# Altium project MercurialSDR.PrjPcb
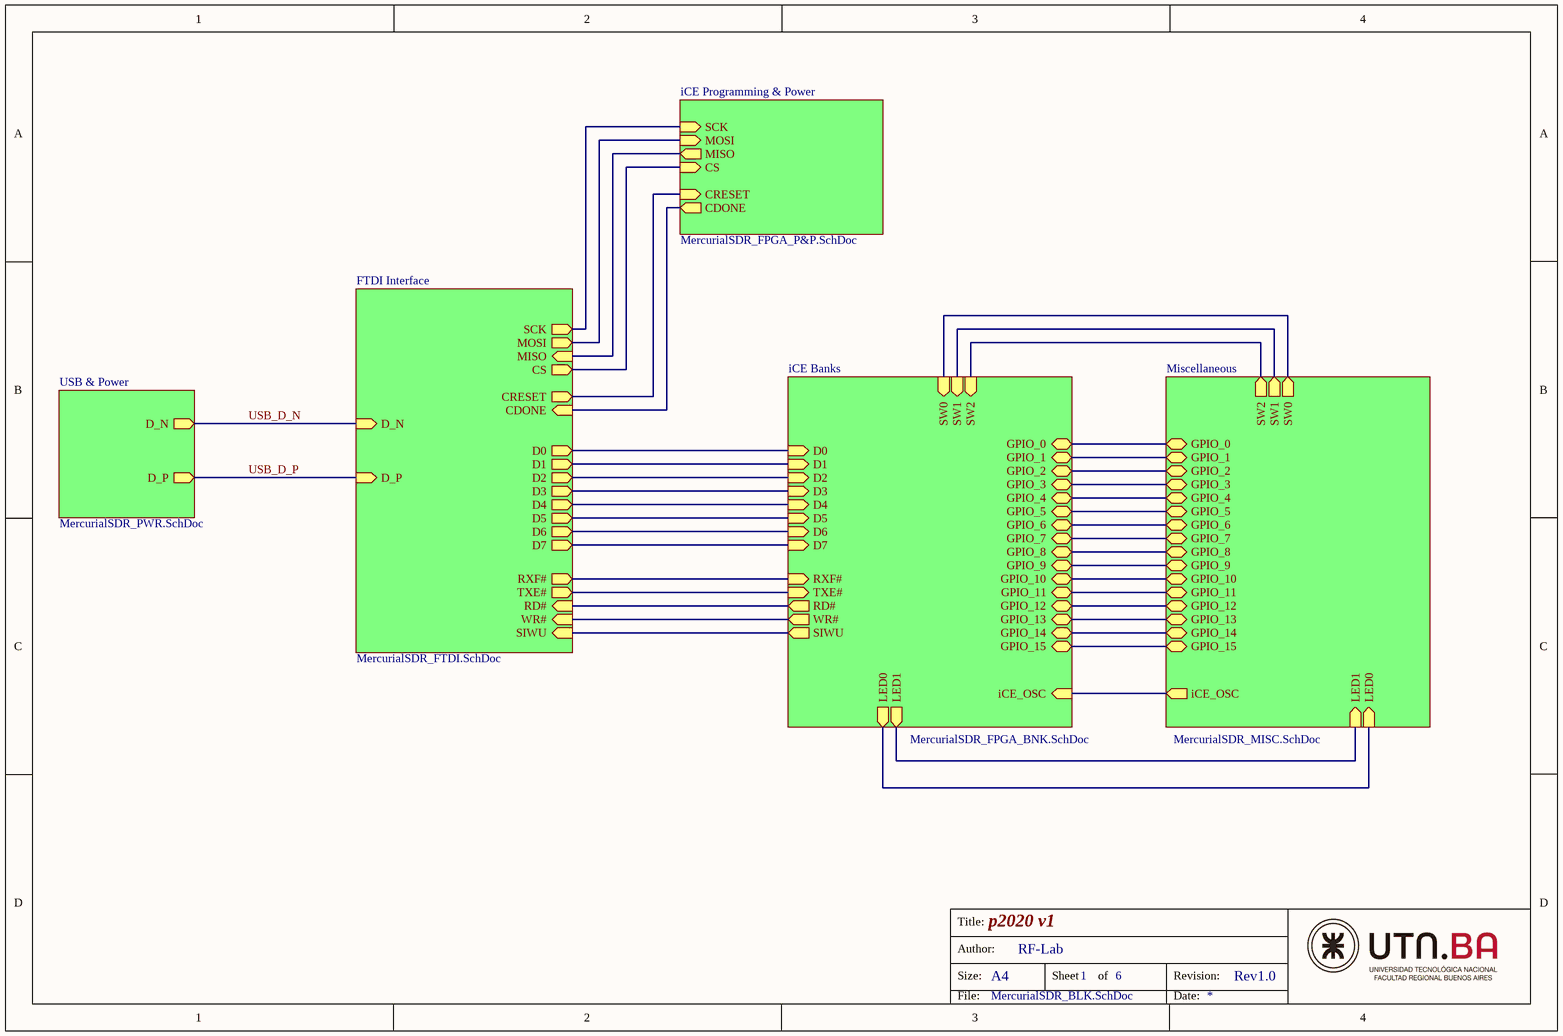
[diagram p0: MercurialSDR_BLK.SchDoc]
6 sheets, 130 parts. Net scope: hierarchical (ports join the sheet entries above them; power ports are global).
Board file: MercurialSDR.PcbDoc
Sheets:
  MercurialSDR_BLK.SchDoc
    Miscellaneous = MercurialSDR_MISC.SchDoc
    iCE Banks = MercurialSDR_FPGA_BNK.SchDoc
    iCE Programming & Power = MercurialSDR_FPGA_P&P.SchDoc
    FTDI Interface = MercurialSDR_FTDI.SchDoc
    USB & Power = MercurialSDR_PWR.SchDoc

## Sheet MercurialSDR_BLK.SchDoc: p2020 v1
size A4; Author: RF-Lab; DrawnBy: RF-Lab; Revision: Rev1.0; SheetNumber: 1; SheetTotal: 6; ProjectName: MercurialSDR

### Sub-sheets
FTDI Interface = MercurialSDR_FTDI.SchDoc: SCK (out), MOSI (out), MISO (in), CS (out), CDONE (in), CRESET (out), D0 (out), D1 (out), D2 (out), D3 (out), D4 (out), D5 (out), D6 (out), D7 (out), RXF# (out), TXE# (out), RD# (in), WR# (in), SIWU (in), D_N (in), D_P (in)
iCE Banks = MercurialSDR_FPGA_BNK.SchDoc: LED0 (out), LED1 (out), SW0 (in), SW1 (in), SW2 (in), GPIO_0 (bidir), GPIO_1 (bidir), GPIO_2 (bidir), GPIO_3 (bidir), GPIO_4 (bidir), GPIO_5 (bidir), GPIO_6 (bidir), GPIO_7 (bidir), GPIO_8 (bidir), GPIO_9 (bidir), GPIO_10 (bidir), GPIO_11 (bidir), GPIO_12 (bidir), GPIO_13 (bidir), GPIO_14 (bidir), GPIO_15 (bidir), D3 (in), RXF# (in), D0 (in), TXE# (in), D7 (in), SIWU (out), D2 (in), D6 (in), D1 (in), D4 (in), WR# (out), RD# (out), D5 (in), iCE_OSC (in)
iCE Programming & Power = MercurialSDR_FPGA_P&P.SchDoc: CRESET (in), CDONE (out), CS (in), SCK (in), MOSI (in), MISO (out)
Miscellaneous = MercurialSDR_MISC.SchDoc: SW0 (out), SW1 (out), SW2 (out), LED0 (in), LED1 (in), GPIO_0 (bidir), GPIO_1 (bidir), GPIO_2 (bidir), GPIO_3 (bidir), GPIO_4 (bidir), GPIO_5 (bidir), GPIO_6 (bidir), GPIO_7 (bidir), GPIO_8 (bidir), GPIO_9 (bidir), GPIO_10 (bidir), GPIO_11 (bidir), GPIO_12 (bidir), GPIO_13 (bidir), GPIO_14 (bidir), GPIO_15 (bidir), iCE_OSC (out)
USB & Power = MercurialSDR_PWR.SchDoc: D_N (out), D_P (out)

### Nets
CDONE_S: sheet iCE Programming & Power/CDONE, sheet FTDI Interface/CDONE
CS_S: sheet iCE Programming & Power/CS, sheet FTDI Interface/CS
MISO_S: sheet iCE Programming & Power/MISO, sheet FTDI Interface/MISO
MOSI_S: sheet iCE Programming & Power/MOSI, sheet FTDI Interface/MOSI
RESET_S: sheet iCE Programming & Power/CRESET, sheet FTDI Interface/CRESET
SCK_S: sheet iCE Programming & Power/SCK, sheet FTDI Interface/SCK
USB_D_N: sheet FTDI Interface/D_N, sheet USB & Power/D_N
USB_D_P: sheet FTDI Interface/D_P, sheet USB & Power/D_P
NetC41_2: sheet Miscellaneous/SW0, sheet iCE Banks/SW0
NetC42_2: sheet Miscellaneous/SW1, sheet iCE Banks/SW1
NetC43_2: sheet Miscellaneous/SW2, sheet iCE Banks/SW2
NetCN1_5: sheet Miscellaneous/GPIO_0, sheet iCE Banks/GPIO_0
NetCN1_6: sheet Miscellaneous/GPIO_1, sheet iCE Banks/GPIO_1
NetCN1_7: sheet Miscellaneous/GPIO_2, sheet iCE Banks/GPIO_2
NetCN1_8: sheet Miscellaneous/GPIO_3, sheet iCE Banks/GPIO_3
NetCN1_9: sheet Miscellaneous/GPIO_4, sheet iCE Banks/GPIO_4
NetCN1_10: sheet Miscellaneous/GPIO_5, sheet iCE Banks/GPIO_5
NetCN1_11: sheet Miscellaneous/GPIO_6, sheet iCE Banks/GPIO_6
NetCN1_12: sheet Miscellaneous/GPIO_7, sheet iCE Banks/GPIO_7
NetCN1_13: sheet Miscellaneous/GPIO_8, sheet iCE Banks/GPIO_8
NetCN1_14: sheet Miscellaneous/GPIO_9, sheet iCE Banks/GPIO_9
NetCN1_15: sheet Miscellaneous/GPIO_10, sheet iCE Banks/GPIO_10
NetCN1_16: sheet Miscellaneous/GPIO_11, sheet iCE Banks/GPIO_11
NetCN1_17: sheet Miscellaneous/GPIO_12, sheet iCE Banks/GPIO_12
NetCN1_18: sheet Miscellaneous/GPIO_13, sheet iCE Banks/GPIO_13
NetCN1_19: sheet Miscellaneous/GPIO_14, sheet iCE Banks/GPIO_14
NetCN1_20: sheet Miscellaneous/GPIO_15, sheet iCE Banks/GPIO_15
NetIC8_38: sheet iCE Banks/D0, sheet FTDI Interface/D0
NetIC8_39: sheet iCE Banks/D1, sheet FTDI Interface/D1
NetIC8_40: sheet iCE Banks/D2, sheet FTDI Interface/D2
NetIC8_41: sheet iCE Banks/D3, sheet FTDI Interface/D3
NetIC8_43: sheet iCE Banks/D4, sheet FTDI Interface/D4
NetIC8_44: sheet iCE Banks/D5, sheet FTDI Interface/D5
NetIC8_45: sheet iCE Banks/D6, sheet FTDI Interface/D6
NetIC8_46: sheet iCE Banks/D7, sheet FTDI Interface/D7
NetIC8_48: sheet iCE Banks/RXF#, sheet FTDI Interface/RXF#
NetIC8_52: sheet iCE Banks/TXE#, sheet FTDI Interface/TXE#
NetIC8_53: sheet iCE Banks/RD#, sheet FTDI Interface/RD#
NetIC8_54: sheet iCE Banks/WR#, sheet FTDI Interface/WR#
NetIC8_55: sheet iCE Banks/SIWU, sheet FTDI Interface/SIWU
NetOSC1_3: sheet Miscellaneous/iCE_OSC, sheet iCE Banks/iCE_OSC
NetR22_2: sheet Miscellaneous/LED0, sheet iCE Banks/LED0
NetR23_2: sheet Miscellaneous/LED1, sheet iCE Banks/LED1

### Notes on the sheet
- Title:
- Size:
- Author:
- A4
- Sheet
- of
- Revision:
- File:
- Date:

## Sheet MercurialSDR_MISC.SchDoc: p2020 v1
size A4; Author: RF-Lab; DrawnBy: RF-Lab; Revision: Rev1.0; SheetNumber: 6; SheetTotal: 6; ProjectName: MercurialSDR
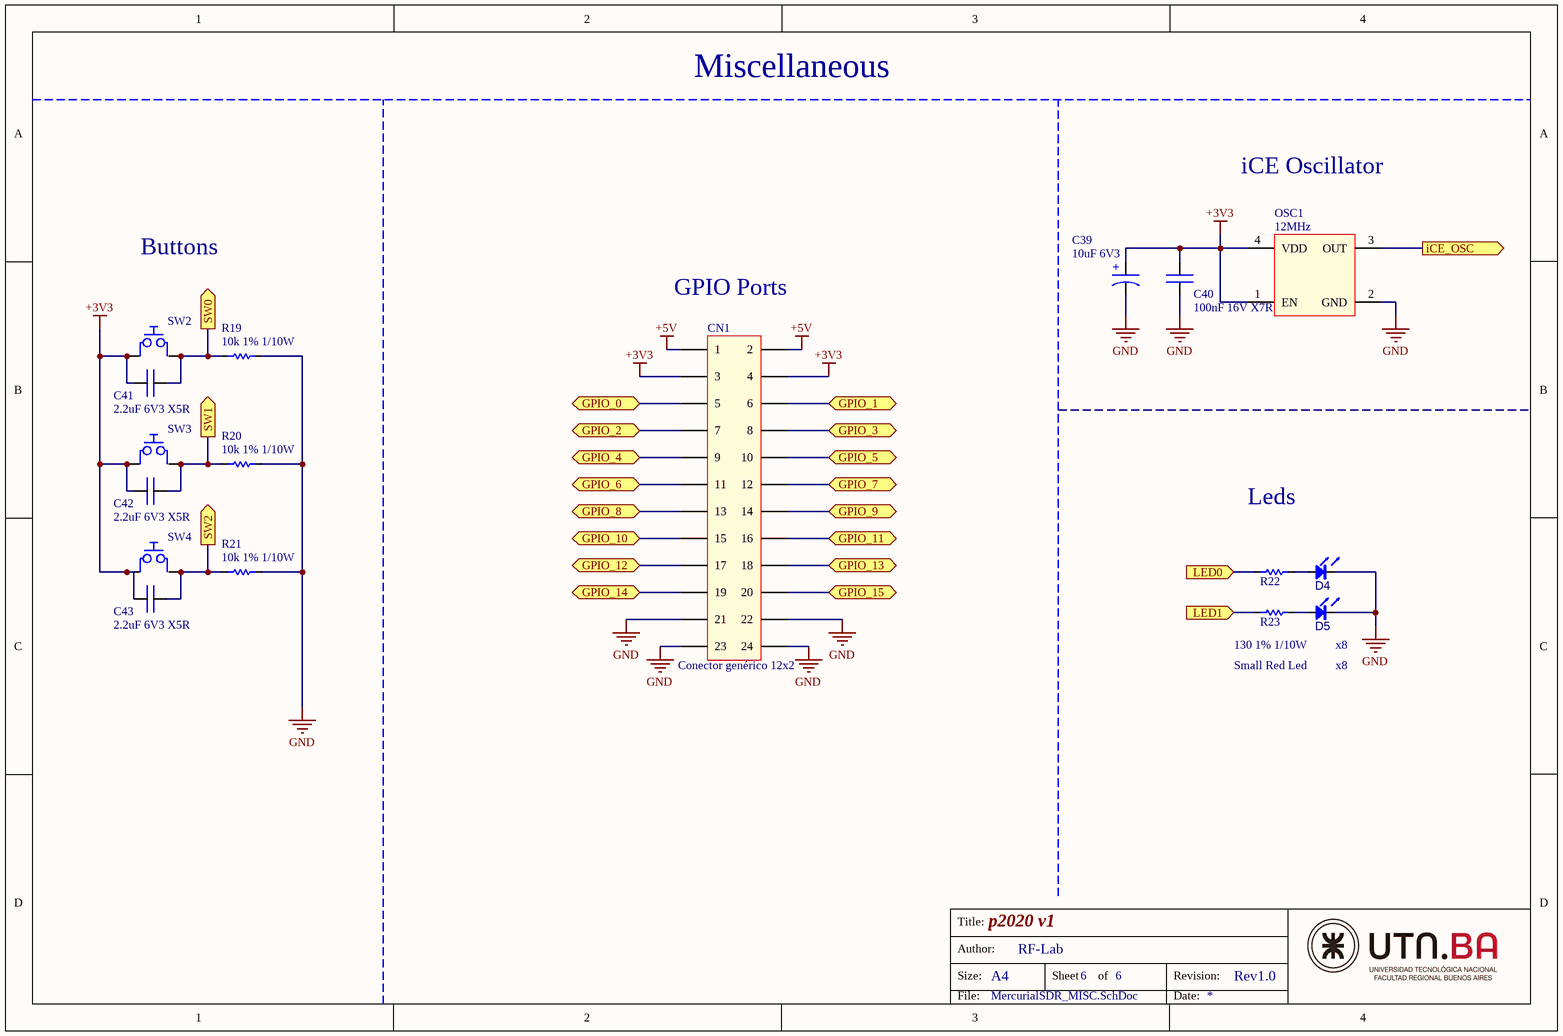
[diagram p1: MercurialSDR_MISC.SchDoc]

### Parts
C39  value 10uF 6V3  [CAP_TANT_1206]  (hidden comment: 10uF 6V3 - TAJA106K006RNJ)
C40  value 100nF 16V X7R  [CAP_0603]  (hidden comment: 100nF 16V X7R - CL10B104KO8NNNC)
C41  value 2.2uF 6V3 X5R  [CAP_0603]  (hidden comment: 2.2uF 6V3 X5R - CL10A225KQ8NNNC)
C42  value 2.2uF 6V3 X5R  [CAP_0603]  (hidden comment: 2.2uF 6V3 X5R - CL10A225KQ8NNNC)
C43  value 2.2uF 6V3 X5R  [CAP_0603]  (hidden comment: 2.2uF 6V3 X5R - CL10A225KQ8NNNC)
CN1  value Conector genérico 12x2  [CON_12x2]  (hidden comment: 6-534236-2 // PPPC122LFBN)
D4  LTST-C190KRKT  [LED_0603]  (value not drawn)
D5  Color: Small Red Led  [LED_0603]  (hidden comment: LTST-C190KRKT)
OSC1  Frequency: 12MHz  [VFLGA_2.5x2.0]  (hidden comment: DSC6003JI2A-012.0000T)
R19  value 10k 1% 1/10W  [RES_0603]  (hidden comment: 10k 1% 1/10W - CR0603-FX-1002EAS)
R20  value 10k 1% 1/10W  [RES_0603]  (hidden comment: 10k 1% 1/10W - CR0603-FX-1002EAS)
R21  value 10k 1% 1/10W  [RES_0603]  (hidden comment: 10k 1% 1/10W - CR0603-FX-1002EAS)
R22  130 1% 1/10W - CR0603-FX-1300ELF  [RES_0603]  (value not drawn)
R23  value 130 1% 1/10W  [RES_0603]  (hidden comment: 130 1% 1/10W - CR0603-FX-1300ELF)
SW2  PTS645SM43SMTR92 LFS  [SWITCH_6X6mm]  (value not drawn)
SW3  PTS645SM43SMTR92 LFS  [SWITCH_6X6mm]  (value not drawn)
SW4  PTS645SM43SMTR92 LFS  [SWITCH_6X6mm]  (value not drawn)

### Ports
GPIO_0 (bidir), GPIO_1 (bidir), GPIO_2 (bidir), GPIO_3 (bidir), GPIO_4 (bidir), GPIO_5 (bidir), GPIO_6 (bidir), GPIO_7 (bidir), GPIO_8 (bidir), GPIO_9 (bidir), GPIO_10 (bidir), GPIO_11 (bidir), GPIO_12 (bidir), GPIO_13 (bidir), GPIO_14 (bidir), GPIO_15 (bidir), iCE_OSC (out), LED0 (in), LED1 (in), SW0 (out), SW1 (out), SW2 (out)

### Nets
+3V3: C39.1 C40.1 C41.1 C42.1 C43.1 CN1.3 CN1.4 OSC1.1(EN) OSC1.4(VDD) SW2.1 SW3.1 SW4.1
+5V: CN1.1 CN1.2
GND: C39.2 C40.2 CN1.21 CN1.22 CN1.23 CN1.24 D4.2(K) D5.2(K) OSC1.2(GND) R19.1 R20.1 R21.1
NetC41_2: C41.2 R19.2 SW2.4 ; port SW0
NetC42_2: C42.2 R20.2 SW3.4 ; port SW1
NetC43_2: C43.2 R21.2 SW4.4 ; port SW2
NetCN1_5: CN1.5 ; port GPIO_0
NetCN1_6: CN1.6 ; port GPIO_1
NetCN1_7: CN1.7 ; port GPIO_2
NetCN1_8: CN1.8 ; port GPIO_3
NetCN1_9: CN1.9 ; port GPIO_4
NetCN1_10: CN1.10 ; port GPIO_5
NetCN1_11: CN1.11 ; port GPIO_6
NetCN1_12: CN1.12 ; port GPIO_7
NetCN1_13: CN1.13 ; port GPIO_8
NetCN1_14: CN1.14 ; port GPIO_9
NetCN1_15: CN1.15 ; port GPIO_10
NetCN1_16: CN1.16 ; port GPIO_11
NetCN1_17: CN1.17 ; port GPIO_12
NetCN1_18: CN1.18 ; port GPIO_13
NetCN1_19: CN1.19 ; port GPIO_14
NetCN1_20: CN1.20 ; port GPIO_15
NetD4_1: D4.1(A) R22.1
NetD5_1: D5.1(A) R23.1
NetOSC1_3: OSC1.3(OUT) ; port iCE_OSC
NetR22_2: R22.2 ; port LED0
NetR23_2: R23.2 ; port LED1

Not connected (* = marked no-connect by the designer): SW2 2 3; SW3 2 3; SW4 2 3

### Notes on the sheet
- Miscellaneous
- iCE Oscillator
- Buttons
- (near CN1) GPIO Ports
- Leds
- x8
- Title:
- Size:
- Author:
- A4
- Sheet
- of
- Revision:
- File:
- Date:
- (in symbol Cap Pol) +

### Library data of the parts
C39 = Cap Pol: Capacitor polarizado
C40 C42 C43 = Cap: Capacitor no polarizado; Material: Ceramic
  C40: Temp Coef: X7R; Part Number: CL10B104KO8NNNC; VR: 16V
  C42 C43: Temp Coef: X5R; Part Number: CL10A225KQ8NNNC; VR: 6V3
C41 = Cap: Capacitor no polarizado
CN1 = CN_12x2: Conector genérico 12x2; Part Number: 6-534236-2
D4 = Led_small: Color: Red; Part Number: LTST-C190KRKT
D5 = Led_small: Part Number: LTST-C190KRKT
OSC1 = Oscillator: Oscilador de 4 terminales; Part Number: DSC6003JI2A-012.0000T
R19-R21 R23 = Res: Resistor
  R23: Power: 1/10W; Part Number: CR0603-FX-1300ELF; Tolerance: 1%
R22 = Res: Resistor; Value: 130; Power: 1/10W; Part Number: CR0603-FX-1300ELF; Tolerance: 1%
SW2-SW4 = Pulsador: Part Number: PTS645SM43SMTR92 LFS

## Sheet MercurialSDR_FPGA_BNK.SchDoc: p2020 v1
size A4; Author: RF-Lab; DrawnBy: RF-Lab; Revision: Rev1.0; SheetNumber: 5; SheetTotal: 6; ProjectName: MercurialSDR
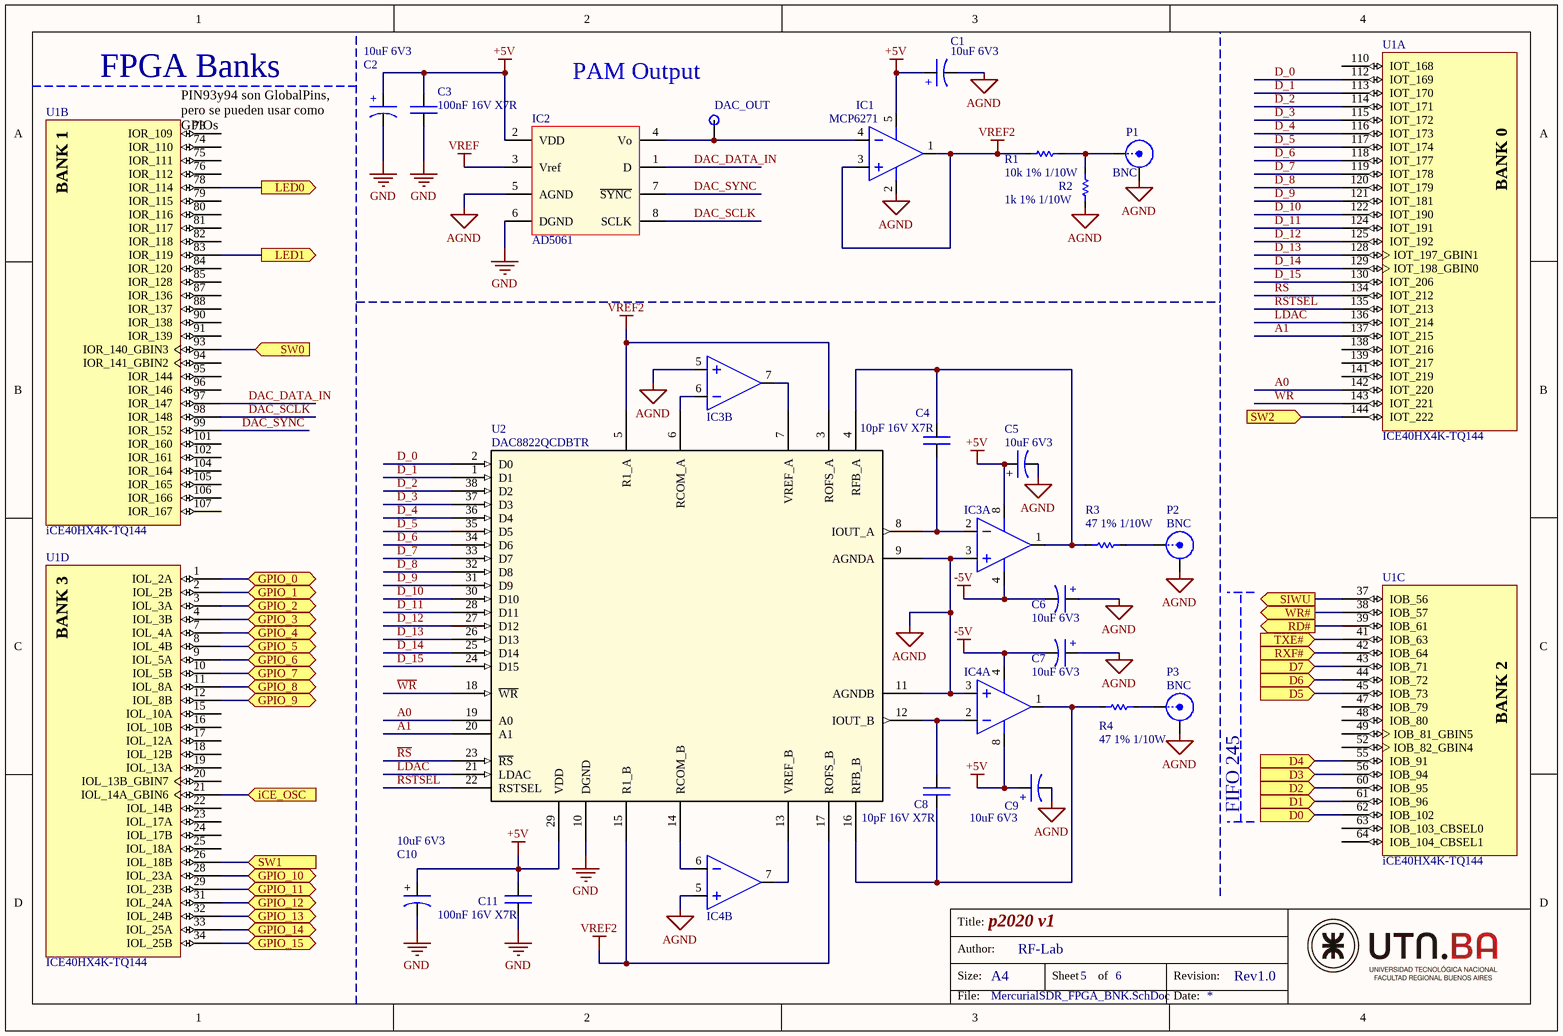
[diagram p2: MercurialSDR_FPGA_BNK.SchDoc]

### Parts
C1  value 10uF 6V3  [CAP_TANT_1206]  (hidden comment: 10uF 6V3 - TAJA106K006RNJ)
C2  value 10uF 6V3  [CAP_TANT_1206]  (hidden comment: 10uF 6V3 - TAJA106K006RNJ)
C3  value 100nF 16V X7R  [CAP_0603]  (hidden comment: 100nF 16V X7R - CL10B104KO8NNNC)
C4  value 10pF 16V X7R  [CAP_0603]  (hidden comment: 10pF 16V X7R - C0603C100K4RAC7867)
C5  value 10uF 6V3  [CAP_TANT_1206]  (hidden comment: 10uF 6V3 - TAJA106K006RNJ)
C6  value 10uF 6V3  [CAP_TANT_1206]  (hidden comment: 10uF 6V3 - TAJA106K006RNJ)
C7  value 10uF 6V3  [CAP_TANT_1206]  (hidden comment: 10uF 6V3 - TAJA106K006RNJ)
C8  value 10pF 16V X7R  [CAP_0603]  (hidden comment: 10pF 16V X7R - C0603C100K4RAC7867)
C9  value 10uF 6V3  [CAP_TANT_1206]  (hidden comment: 10uF 6V3 - TAJA106K006RNJ)
C10  value 10uF 6V3  [CAP_TANT_1206]  (hidden comment: 10uF 6V3 - TAJA106K006RNJ)
C11  value 100nF 16V X7R  [CAP_0603]  (hidden comment: 100nF 16V X7R - CL10B104KO8NNNC)
IC1  Part Number: MCP6271  [SOT-23-5]  (hidden comment: MCP6271 SOT-23-5)
IC2  AD5061  [SOT-23-8]
IC3  OPAMP2277 - OPA2277UA/2K5  [opa2277]  (value not drawn)  (parts A,B of 2)
IC4  OPAMP2277 - OPA2277UA/2K5  [opa2277]  (value not drawn)  (parts A,B of 2)
P1  value BNC  [CONN_73138-5033_]  (hidden comment: 0731385033)
P2  value BNC  [CONN_73138-5033_]  (hidden comment: 0731385033)
P3  value BNC  [CONN_73138-5033_]  (hidden comment: 0731385033)
R1  value 10k 1% 1/10W  [RES_0603]  (hidden comment: 10k 1% 1/10W - CR0603-FX-1002EAS)
R2  value 1k 1% 1/10W  [RES_0603]  (hidden comment: 1k 1% 1/10W - CR0603-FX-1001ELF)
R3  value 47 1% 1/10W  [RES_0603]  (hidden comment: 47 1% 1/10W - CR0603-FX-47R0ELF)
R4  value 47 1% 1/10W  [RES_0603]  (hidden comment: 47 1% 1/10W - CR0603-FX-47R0ELF)
TP1  TP Name: DAC_OUT  [TP_TH]  (hidden comment: Test Point)
U1  ICE40HX4K-TQ144  [LATC-TQFP-144_L]  (parts A,B,C,D of 6)
U2  DAC8822QCDBTR  [dac8822]

### Ports
D0 (in), D1 (in), D2 (in), D3 (in), D4 (in), D5 (in), D6 (in), D7 (in), GPIO_0 (bidir), GPIO_1 (bidir), GPIO_2 (bidir), GPIO_3 (bidir), GPIO_4 (bidir), GPIO_5 (bidir), GPIO_6 (bidir), GPIO_7 (bidir), GPIO_8 (bidir), GPIO_9 (bidir), GPIO_10 (bidir), GPIO_11 (bidir), GPIO_12 (bidir), GPIO_13 (bidir), GPIO_14 (bidir), GPIO_15 (bidir), iCE_OSC (in), LED0 (out), LED1 (out), RD# (out), RXF# (in), SIWU (out), SW0 (in), SW1 (in), SW2 (in), TXE# (in), WR# (out)

### Nets
+5V: C1.1 C2.1 C3.1 C5.1 C9.1 C10.1 C11.1 IC1.5(Vs+) IC2.2(VDD) IC3.8(Vs+) IC4.8(Vs+) U2.29(VDD)
-5V: C6.2 C7.2 IC3.4(Vs-) IC4.4(Vs-)
AGND: C1.2 C5.2 C6.1 C7.1 C9.2 IC1.2(Vs-) IC2.5(AGND) IC3.3(V+) IC3.5(V+) IC4.3(V+) IC4.5(V+) P1.2(Y) P2.2(Y) P3.2(Y) R2.2 U2.9(AGNDA) U2.11(AGNDB)
GND: C2.2 C3.2 C10.2 C11.2 IC2.6(DGND) U2.10(DGND)
VREF: IC2.3(Vref)
VREF2: IC1.1(Vo) IC1.3(V+) R1.1 U2.3(ROFS_A) U2.5(R1_A) U2.15(R1_B) U2.17(ROFS_B)
A0: U1.142(IOT_220) U2.19(A0)
A1: U1.137(IOT_215) U2.20(A1)
D_0: U1.112(IOT_169) U2.2(D0)
D_1: U1.113(IOT_170) U2.1(D1)
D_2: U1.114(IOT_171) U2.38(D2)
D_3: U1.115(IOT_172) U2.37(D3)
D_4: U1.116(IOT_173) U2.36(D4)
D_5: U1.117(IOT_174) U2.35(D5)
D_6: U1.118(IOT_177) U2.34(D6)
D_7: U1.119(IOT_178) U2.33(D7)
D_8: U1.120(IOT_179) U2.32(D8)
D_9: U1.121(IOT_181) U2.31(D9)
D_10: U1.122(IOT_190) U2.30(D10)
D_11: U1.124(IOT_191) U2.28(D11)
D_12: U1.125(IOT_192) U2.27(D12)
D_13: U1.128(IOT_197_GBIN1) U2.26(D13)
D_14: U1.129(IOT_198_GBIN0) U2.25(D14)
D_15: U1.130(IOT_206) U2.24(D15)
DAC_DATA_IN: IC2.1(D) U1.97(IOR_147)
DAC_SCLK: IC2.8(SCLK) U1.98(IOR_148)
DAC_SYNC: IC2.7(~{SYNC}) U1.99(IOR_152)
LDAC: U1.136(IOT_214) U2.21(LDAC)
~{RS}: U1.134(IOT_212) U2.23(~{RS})
RSTSEL: U1.135(IOT_213) U2.22(RSTSEL)
~{WR}: U1.143(IOT_221) U2.18(~{WR})
NetC4_1: C4.1 IC3.1(Vo) R3.1 U2.4(RFB_A)
NetC4_2: C4.2 IC3.2(V-) U2.8(IOUT_A)
NetC8_1: C8.1 IC4.2(V-) U2.12(IOUT_B)
NetC8_2: C8.2 IC4.1(Vo) R4.1 U2.16(RFB_B)
NetC41_2: U1.93(IOR_140_GBIN3) ; port SW0
NetC42_2: U1.26(IOL_18B) ; port SW1
NetC43_2: U1.144(IOT_222) ; port SW2
NetCN1_5: U1.1(IOL_2A) ; port GPIO_0
NetCN1_6: U1.2(IOL_2B) ; port GPIO_1
NetCN1_7: U1.3(IOL_3A) ; port GPIO_2
NetCN1_8: U1.4(IOL_3B) ; port GPIO_3
NetCN1_9: U1.7(IOL_4A) ; port GPIO_4
NetCN1_10: U1.8(IOL_4B) ; port GPIO_5
NetCN1_11: U1.9(IOL_5A) ; port GPIO_6
NetCN1_12: U1.10(IOL_5B) ; port GPIO_7
NetCN1_13: U1.11(IOL_8A) ; port GPIO_8
NetCN1_14: U1.12(IOL_8B) ; port GPIO_9
NetCN1_15: U1.28(IOL_23A) ; port GPIO_10
NetCN1_16: U1.29(IOL_23B) ; port GPIO_11
NetCN1_17: U1.31(IOL_24A) ; port GPIO_12
NetCN1_18: U1.32(IOL_24B) ; port GPIO_13
NetCN1_19: U1.33(IOL_25A) ; port GPIO_14
NetCN1_20: U1.34(IOL_25B) ; port GPIO_15
NetIC1_4: IC1.4(V-) IC2.4(Vo) TP1.1(TP?)
NetIC3_6: IC3.6(V-) U2.6(RCOM_A)
NetIC3_7: IC3.7(Vo) U2.7(VREF_A)
NetIC4_6: IC4.6(V-) U2.14(RCOM_B)
NetIC4_7: IC4.7(Vo) U2.13(VREF_B)
NetIC8_38: U1.62(IOB_102) ; port D0
NetIC8_39: U1.61(IOB_96) ; port D1
NetIC8_40: U1.60(IOB_95) ; port D2
NetIC8_41: U1.56(IOB_94) ; port D3
NetIC8_43: U1.55(IOB_91) ; port D4
NetIC8_44: U1.45(IOB_73) ; port D5
NetIC8_45: U1.44(IOB_72) ; port D6
NetIC8_46: U1.43(IOB_71) ; port D7
NetIC8_48: U1.42(IOB_64) ; port RXF#
NetIC8_52: U1.41(IOB_63) ; port TXE#
NetIC8_53: U1.39(IOB_61) ; port RD#
NetIC8_54: U1.38(IOB_57) ; port WR#
NetIC8_55: U1.37(IOB_56) ; port SIWU
NetOSC1_3: U1.21(IOL_14A_GBIN6) ; port iCE_OSC
NetP1_1: P1.1(X) R1.2 R2.1
NetP2_1: P2.1(X) R3.2
NetP3_1: P3.1(X) R4.2
NetR22_2: U1.78(IOR_114) ; port LED0
NetR23_2: U1.83(IOR_119) ; port LED1

Not connected (* = marked no-connect by the designer): U1 15(IOL_10A) 16(IOL_10B) 17(IOL_12A) 18(IOL_12B) 19(IOL_13A) 20(IOL_13B_GBIN7) 22(IOL_14B) 23(IOL_17A) 24(IOL_17B) 25(IOL_18A) 47(IOB_79) 48(IOB_80) 49(IOB_81_GBIN5) 52(IOB_82_GBIN4) 63(IOB_103_CBSEL0) 64(IOB_104_CBSEL1) 73(IOR_109) 74(IOR_110) 75(IOR_111) 76(IOR_112) 79(IOR_115) 80(IOR_116) 81(IOR_117) 82(IOR_118) 84(IOR_120) 85(IOR_128) 87(IOR_136) 88(IOR_137) 90(IOR_138) 91(IOR_139) 94(IOR_141_GBIN2) 95(IOR_144) 96(IOR_146) 101(IOR_160) 102(IOR_161) 104(IOR_164) 105(IOR_165) 106(IOR_166) 107(IOR_167) 110(IOT_168) 138(IOT_216) 139(IOT_217) 141(IOT_219)

### Notes on the sheet
- (near U1) FPGA Banks
- PAM Output
- (near U1) PIN93y94 son GlobalPins, pero se pueden usar como GPIOs
- (near P3) FIFO 245
- Title:
- Size:
- Author:
- A4
- Sheet
- of
- Revision:
- File:
- Date:
- (in symbol Cap Pol) +
- (in symbol ICE40HX4K-TQ144, part A) BANK 0
- (in symbol ICE40HX4K-TQ144, part B) BANK 1
- (in symbol ICE40HX4K-TQ144, part C) BANK 2
- (in symbol ICE40HX4K-TQ144, part D) BANK 3

### Library data of the parts
C1 C2 C5-C7 C9 C10 = Cap Pol: Capacitor polarizado
C3 C4 C8 C11 = Cap: Capacitor no polarizado
  C4 C8: Temp Coef: *; Part Number: *; VR: *; Material: *
IC1 = MCP6271T-E/OT: Operational Amplifier
IC2 = AD5061: DAC SPI; Bits: *; Part Number: *
IC3 IC4 = OPAMP2277: Operational Amplifier; Part Number: *
P1-P3 = BNC: BNC Elbow Connector; LatestRevisionDate: 17-Jul-2002; LatestRevisionNote: Re-released for DXP Platform.; Publisher: Altium Limited
R1-R4 = Res: Resistor
U1 = ICE40HX4K-TQ144: iCE40 HX4K Series FPGA Family, 3520 Logic Cells, 1.2 V Core, 80 K Embedded RAM Bits, 144-pin TQFP, Pb-Free, Tray; Manufacturer: Lattice Semiconductor; Phase-Locked Loops: 2; Supply Voltage: 1.2V; Logic Cells: 3520; Embedded RAM Bits: 80K; ComponentLink1Description: Manufacturer URL; ComponentLink2Description: Datasheet; DatasheetVersion: Rev. 02.9; Mounting Technology: Surface Mount; ComponentLink3URL: http://www.latticesemi.com/lit/docs/package/pkg.pdf; ComponentLink3Description: Package Specification; ComponentLink1URL: http://www.latticesemi.com/en; ComponentLink2URL: http://www.latticesemi.com/~/media/Documents/DataSheets/iCE/iCE40LPHXFamilyDataSheet.pdf; PackageReference: TQFP-144; Packing: Tray; PartNumber: ICE40HX4K-TQ144; PackageDescription: 144-Pin Thin Quad Flat Package, Body 20 x 20 mm, Pitch 0.5 mm; PackageVersion: Rev. 03.9, 02/2013; RoHS: TRUE
U2 = DAC8822QCDBTR: 16-Bit, Dual, Parallel Input, Multiplying DAC; Vendor: Texas Instruments; Built_By: EMA_UL_Team; Manufacturer_Part_Number: DAC8822QCDBTR; Copyright: Copyright (C) 2018 Accelerated Designs. All rights reserved; RefDes: RefDes; Type: DEV; Value: Value

## Sheet MercurialSDR_FPGA_P&P.SchDoc: p2020 v1
size A4; Author: RF-Lab; DrawnBy: RF-Lab; Revision: Rev1.0; SheetNumber: 4; SheetTotal: 6; ProjectName: MercurialSDR
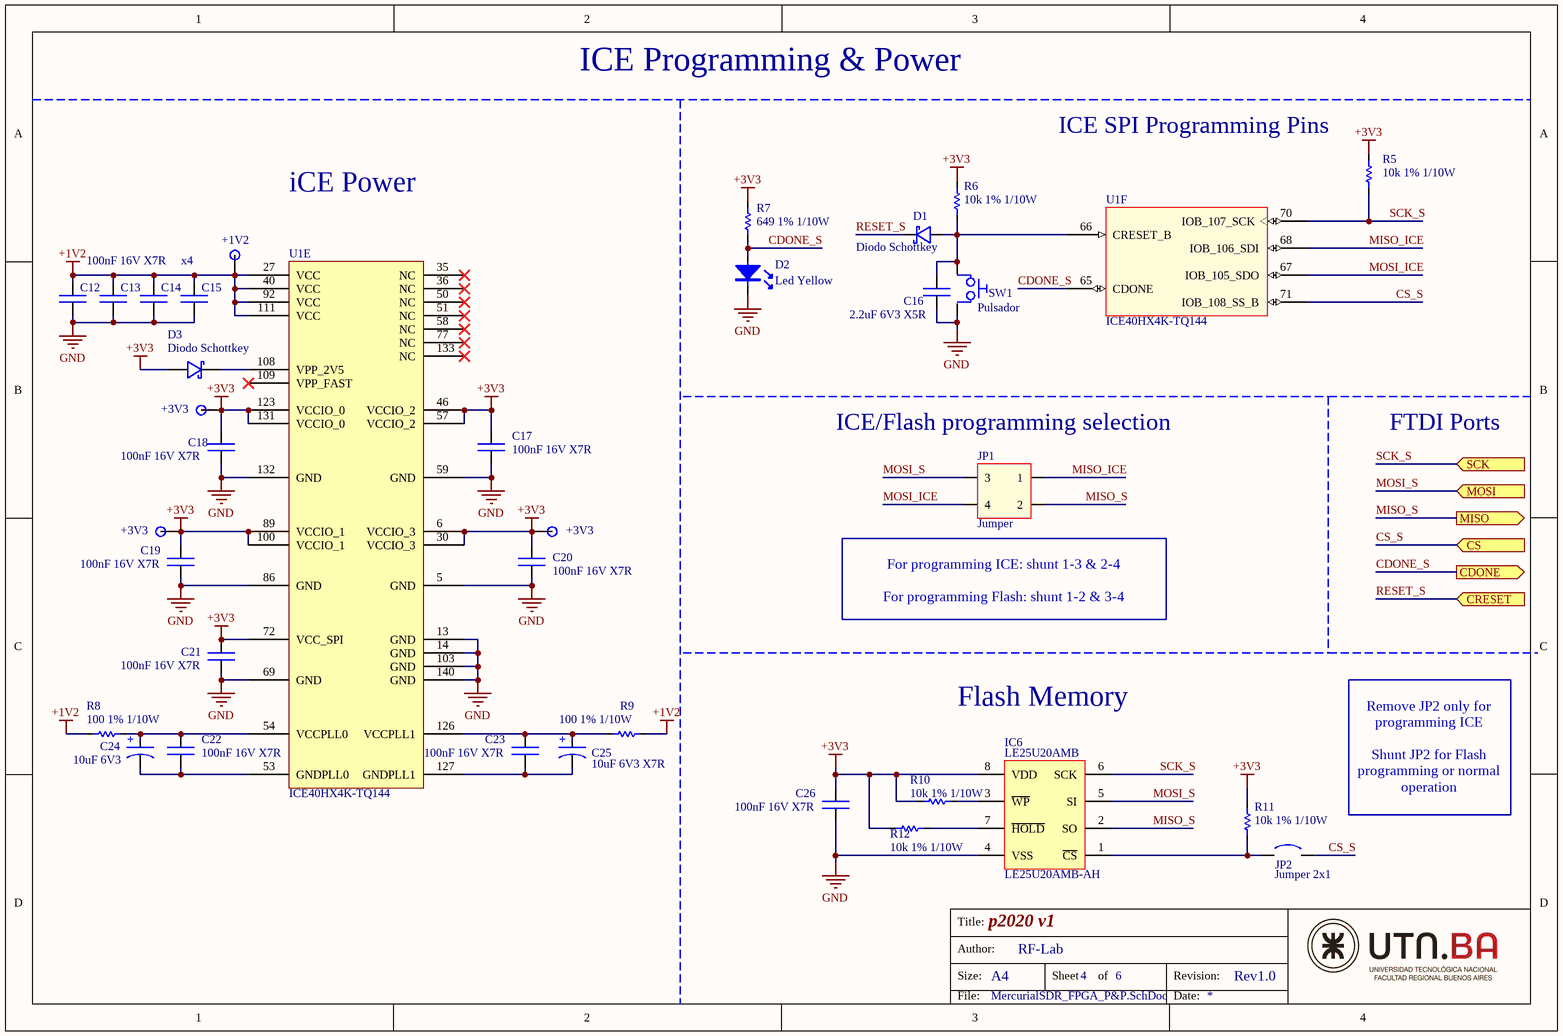
[diagram p3: MercurialSDR_FPGA_P&P.SchDoc]

### Parts
C12  100nF 16V X7R - CL10B104KO8NNNC  [CAP_0603]  (value not drawn)
C13  100nF 16V X7R - CL10B104KO8NNNC  [CAP_0603]  (value not drawn)
C14  100nF 16V X7R - CL10B104KO8NNNC  [CAP_0603]  (value not drawn)
C15  value 100nF 16V X7R  [CAP_0603]  (hidden comment: 100nF 16V X7R - CL10B104KO8NNNC)
C16  value 2.2uF 6V3 X5R  [CAP_0603]  (hidden comment: 2.2uF 6V3 X5R - CL10A225KQ8NNNC)
C17  value 100nF 16V X7R  [CAP_0603]  (hidden comment: 100nF 16V X7R - CL10B104KO8NNNC)
C18  value 100nF 16V X7R  [CAP_0603]  (hidden comment: 100nF 16V X7R - CL10B104KO8NNNC)
C19  value 100nF 16V X7R  [CAP_0603]  (hidden comment: 100nF 16V X7R - CL10B104KO8NNNC)
C20  value 100nF 16V X7R  [CAP_0603]  (hidden comment: 100nF 16V X7R - CL10B104KO8NNNC)
C21  value 100nF 16V X7R  [CAP_0603]  (hidden comment: 100nF 16V X7R - CL10B104KO8NNNC)
C22  value 100nF 16V X7R  [CAP_0603]  (hidden comment: 100nF 16V X7R - CL10B104KO8NNNC)
C23  value 100nF 16V X7R  [CAP_0603]  (hidden comment: 100nF 16V X7R - CL10B104KO8NNNC)
C24  value 10uF 6V3  [CAP_TANT_1206]  (hidden comment: 10uF 6V3 - TAJA106K006RNJ)
C25  value 10uF 6V3 X7R  [CAP_TANT_1206]  (hidden comment: 10uF 6V3 X7R- TAJA106K006RNJ)
C26  value 100nF 16V X7R  [CAP_0603]  (hidden comment: 100nF 16V X7R - CL10B104KO8NNNC)
D1  value Diodo Schottkey  [SOD-523]  (hidden comment: RB521S30T1G)
D2  value Led Yellow  [LED_0603]  (hidden comment: LTST-C190KSKT)
D3  value Diodo Schottkey  [SOD-323]  (hidden comment: NSR0530HT1G)
IC6  LE25U20AMB  Part Number: LE25U20AMB-AH  [SOIC-8]
JP1  Jumper  [Jumper 2x2]
JP2  Jumper 2x1  [Jumper 2x1]
R5  value 10k 1% 1/10W  [RES_0603]  (hidden comment: 10k 1% 1/10W - CR0603-FX-1002EAS)
R6  value 10k 1% 1/10W  [RES_0603]  (hidden comment: 10k 1% 1/10W - CR0603-FX-1002EAS)
R7  value 649 1% 1/10W  [RES_0603]  (hidden comment: 649 1% 1/10W - RC0603FR-07649RL)
R8  value 100 1% 1/10W  [RES_0603]  (hidden comment: 100 1% 1/10W - CR0603-FX-1000ELF)
R9  value 100 1% 1/10W  [RES_0603]  (hidden comment: 100 1% 1/10W - CR0603-FX-1000ELF)
R10  value 10k 1% 1/10W  [RES_0603]  (hidden comment: 10k 1% 1/10W - CR0603-FX-1002EAS)
R11  value 10k 1% 1/10W  [RES_0603]  (hidden comment: 10k 1% 1/10W - CR0603-FX-1002EAS)
R12  value 10k 1% 1/10W  [RES_0603]  (hidden comment: 10k 1% 1/10W - CR0603-FX-1002EAS)
SW1  value Pulsador  [SWITCH_6X6mm]  (hidden comment: PTS645SM43SMTR92 LFS)
TP2  TP Name: +1V2  [TP_TH]  (hidden comment: Test Point)
TP3  TP Name: +3V3  [TP_TH]  (hidden comment: Test Point)
TP4  TP Name: +3V3  [TP_TH]  (hidden comment: Test Point)
TP5  TP Name: +3V3  [TP_TH]  (hidden comment: Test Point)
U1  ICE40HX4K-TQ144  [LATC-TQFP-144_L]  (parts E,F of 6)

### Ports
CDONE (out), CRESET (in), CS (in), MISO (out), MOSI (in), SCK (in)

### Nets
+1V2: C12.1 C13.1 C14.1 C15.1 R8.2 R9.1 TP2.1(TP?) U1.27(VCC) U1.40(VCC) U1.92(VCC) U1.111(VCC)
+3V3: C17.2 C18.2 C19.2 C20.2 C21.2 C26.2 D3.1(A) IC6.8(VDD) R5.1 R6.1 R7.1 R10.1 R11.2 R12.1 TP3.1(TP?) TP4.1(TP?) TP5.1(TP?) U1.6(VCCIO_3) U1.30(VCCIO_3) U1.46(VCCIO_2) U1.57(VCCIO_2) U1.72(VCC_SPI) U1.89(VCCIO_1) U1.100(VCCIO_1) U1.123(VCCIO_0) U1.131(VCCIO_0)
GND: C12.2 C13.2 C14.2 C15.2 C16.2 C17.1 C18.1 C19.1 C20.1 C21.1 C26.1 D2.2(K) IC6.4(VSS) SW1.4 U1.5(GND) U1.13(GND) U1.14(GND) U1.59(GND) U1.69(GND) U1.86(GND) U1.103(GND) U1.132(GND) U1.140(GND)
CDONE_S: D2.1(A) R7.2 U1.65(CDONE) ; port CDONE
CS_S: JP2.2 U1.71(IOB_108_SS_B) ; port CS
MISO_ICE: JP1.1 U1.68(IOB_106_SDI)
MISO_S: IC6.2(SO) JP1.2 ; port MISO
MOSI_ICE: JP1.4 U1.67(IOB_105_SDO)
MOSI_S: IC6.5(SI) JP1.3 ; port MOSI
RESET_S: D1.2(K) ; port CRESET
SCK_S: IC6.6(SCK) R5.2 U1.70(IOB_107_SCK) ; port SCK
NetC16_1: C16.1 D1.1(A) R6.2 SW1.1 U1.66(CRESET_B)
NetC22_1: C22.1 C24.1 R8.1 U1.54(VCCPLL0)
NetC22_2: C22.2 C24.2 U1.53(GNDPLL0)
NetC23_1: C23.1 C25.1 R9.2 U1.126(VCCPLL1)
NetC23_2: C23.2 C25.2 U1.127(GNDPLL1)
NetD3_2: D3.2(K) U1.108(VPP_2V5)
NetIC6_1: IC6.1(~{CS}) JP2.1 R11.1
NetIC6_3: IC6.3(~{WP}) R10.2
NetIC6_7: IC6.7(~{HOLD}) R12.2

Not connected (* = marked no-connect by the designer): SW1 2 3; U1 35(NC)* 36(NC)* 50(NC)* 51(NC)* 58(NC)* 77(NC)* 109(VPP_FAST)* 133(NC)*

### Notes on the sheet
- ICE Programming & Power
- (near R5) ICE SPI Programming Pins
- iCE Power
- x4
- (near JP1) ICE/Flash programming selection
- FTDI Ports
- (near JP1) For programming ICE: shunt 1-3 & 2-4
  For programming Flash: shunt 1-2 & 3-4
- Flash Memory
- Remove JP2 only for programming ICE
  Shunt JP2 for Flash programming or normal operation
- Title:
- Size:
- Author:
- A4
- Sheet
- of
- Revision:
- File:
- Date:
- (in symbol Cap Pol) +

### Library data of the parts
C12 C15-C23 C26 = Cap: Capacitor no polarizado
  C12: Value: 100nF 16V X7R
C13 C14 = Cap: as C40 on sheet MercurialSDR_MISC; Value: 100nF; Temp Coef: X7R; Part Number: CL10B104KO8NNNC; VR: 16V
C24 C25 = Cap Pol: Capacitor polarizado
D1 D3 = Diodo_Schottky: Diodo Schottkey
  D3: Part Number: NSR0530HT1G
D2 = Led
IC6 = LE25U20AMB: Flash Memmory SPI (256Kx8)
JP1 = Jumper 2x2
JP2 = Jumper: Part Number: *
R5-R12 = Res: Resistor
  R9: Power: 1/10W; Part Number: CR0603-FX-1000ELF; Tolerance: 1%
SW1 = Pulsador
U1 = ICE40HX4K-TQ144: as U1 on sheet MercurialSDR_FPGA_BNK; ComponentLink1Description: Manufacturer URL; ComponentLink2Description: Datasheet; DatasheetVersion: Rev. 02.9; Mounting Technology: Surface Mount; ComponentLink3URL: http://www.latticesemi.com/lit/docs/package/pkg.pdf; ComponentLink3Description: Package Specification; ComponentLink1URL: http://www.latticesemi.com/en; ComponentLink2URL: http://www.latticesemi.com/~/media/Documents/DataSheets/iCE/iCE40LPHXFamilyDataSheet.pdf; PackageReference: TQFP-144; Packing: Tray; Part Number: ICE40HX4K-TQ144; PackageDescription: 144-Pin Thin Quad Flat Package, Body 20 x 20 mm, Pitch 0.5 mm; PackageVersion: Rev. 03.9, 02/2013; RoHS: TRUE

## Sheet MercurialSDR_FTDI.SchDoc: p2020 v1
size A4; Author: RF-Lab; DrawnBy: RF-Lab; Revision: Rev1.0; SheetNumber: 3; SheetTotal: 6; ProjectName: MercurialSDR
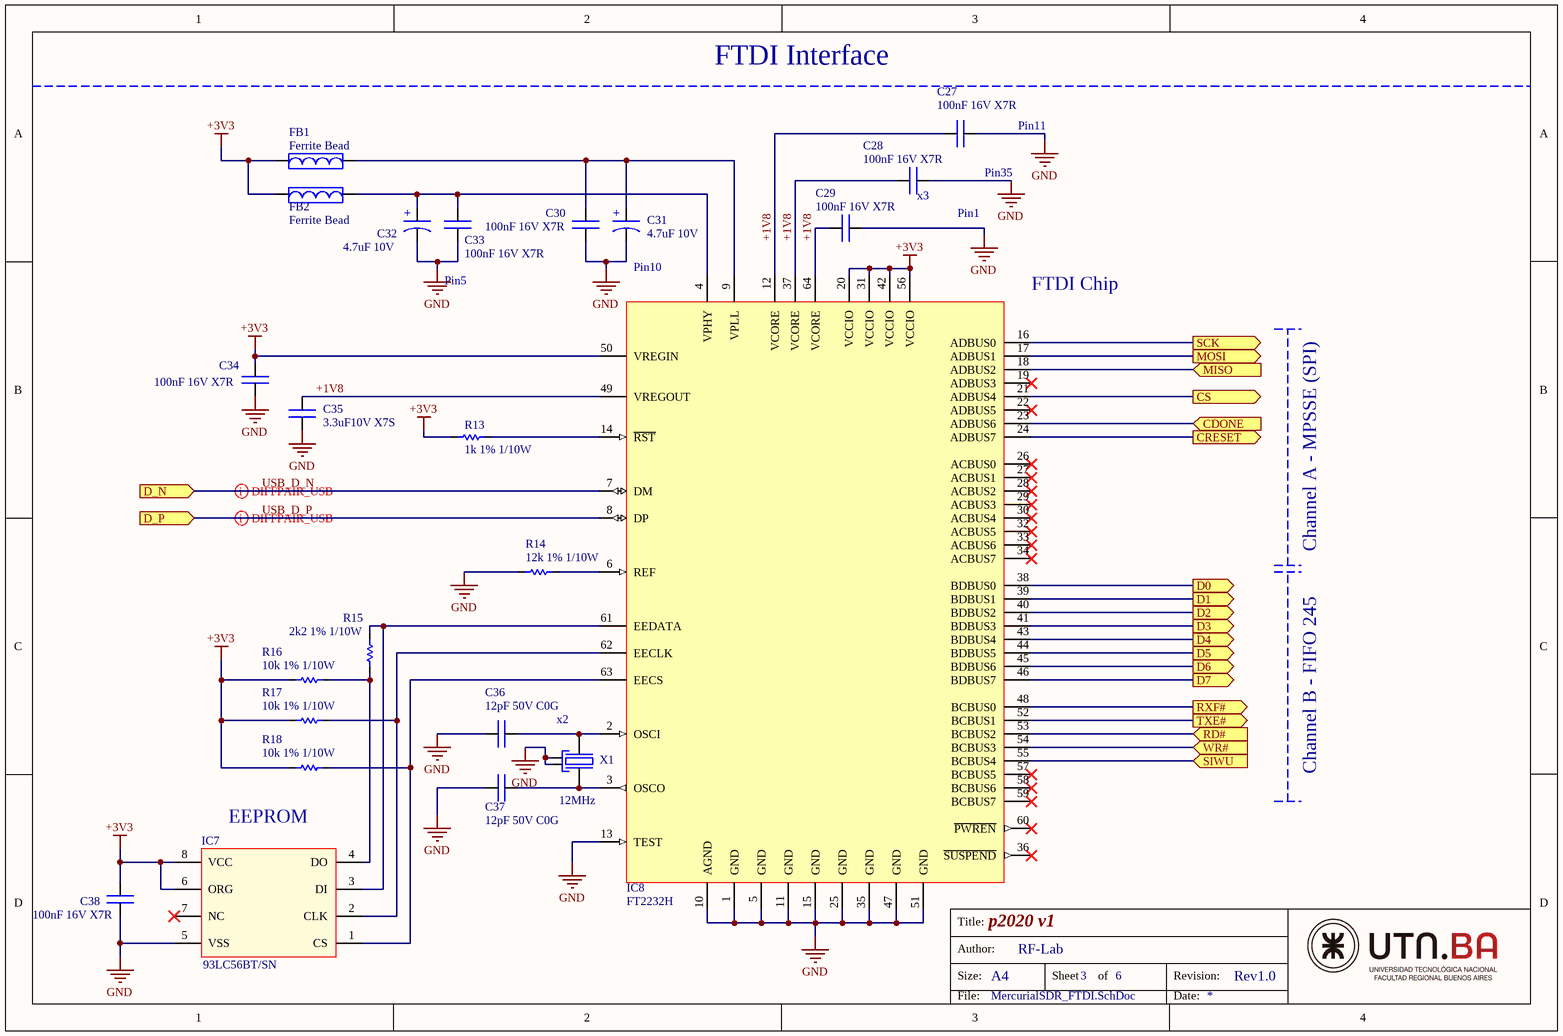
[diagram p4: MercurialSDR_FTDI.SchDoc]

### Parts
C27  value 100nF 16V X7R  [CAP_0603]  (hidden comment: 100nF 16V X7R - CL10B104KO8NNNC)
C28  value 100nF 16V X7R  [CAP_0603]  (hidden comment: 100nF 16V X7R - CL10B104KO8NNNC)
C29  value 100nF 16V X7R  [CAP_0603]  (hidden comment: 100nF 16V X7R - CL10B104KO8NNNC)
C30  value 100nF 16V X7R  [CAP_0603]  (hidden comment: 100nF 16V X7R - CL10B104KO8NNNC)
C31  value 4.7uF 10V  [CAP_TANT_1206]  (hidden comment: 4.7uF 10V - TAJA475K010RNJ)
C32  value 4.7uF 10V  [CAP_TANT_1206]  (hidden comment: 4.7uF 10V - TAJA475K010RNJ)
C33  value 100nF 16V X7R  [CAP_0603]  (hidden comment: 100nF 16V X7R - CL10B104KO8NNNC)
C34  value 100nF 16V X7R  [CAP_0603]  (hidden comment: 100nF 16V X7R - CL10B104KO8NNNC)
C35  value 3.3uF10V X7S  [CAP_0603]  (hidden comment: 3.3uF10V X7S - C1608X7S1A335K080AC)
C36  value 12pF 50V C0G  [CAP_0603]  (hidden comment: 12pF 50V C0G - CL10C120JB8NNNC)
C37  value 12pF 50V C0G  [CAP_0603]  (hidden comment: 12pF 50V C0G - CL10C120JB8NNNC)
C38  value 100nF 16V X7R  [CAP_0603]  (hidden comment: 100nF 16V X7R - CL10B104KO8NNNC)
FB1  BLM18AG121SN1D  [FERRITE_BEAD_0603]  (value not drawn)
FB2  BLM18AG121SN1D  [FERRITE_BEAD_0603]  (value not drawn)
IC7  93LC56BT  [SOIC-8]  (value not drawn)
IC8  value FT2232H  [LQFP_64]  (hidden comment: FT2232HL-TRAY)
R13  value 1k 1% 1/10W  [RES_0603]  (hidden comment: 1k 1% 1/10W - CR0603-FX-1001ELF)
R14  value 12k 1% 1/10W  [RES_0603]  (hidden comment: 12k 1% 1/10W - CR0603-FX-1202ELF)
R15  value 2k2 1% 1/10W  [RES_0603]  (hidden comment: 2k2 1% 1/10W - AC0603FR-072K2L)
R16  value 10k 1% 1/10W  [RES_0603]  (hidden comment: 10k 1% 1/10W - CR0603-FX-1002EAS)
R17  value 10k 1% 1/10W  [RES_0603]  (hidden comment: 10k 1% 1/10W - CR0603-FX-1002EAS)
R18  value 10k 1% 1/10W  [RES_0603]  (hidden comment: 10k 1% 1/10W - CR0603-FX-1002EAS)
X1  value 12MHz  [XTAL_3.2x2.5]  (hidden comment: ECS-120-12-33-AGN-TR)

### Ports
CDONE (in), CRESET (out), CS (out), D0 (out), D1 (out), D2 (out), D3 (out), D4 (out), D5 (out), D6 (out), D7 (out), D_N (in), D_P (in), MISO (in), MOSI (out), RD# (in), RXF# (out), SCK (out), SIWU (in), TXE# (out), WR# (in)

### Nets
+3V3: C34.1 C38.1 FB1.1 FB2.1 IC7.6(ORG) IC7.8(VCC) IC8.20(VCCIO) IC8.31(VCCIO) IC8.42(VCCIO) IC8.50(VREGIN) IC8.56(VCCIO) R13.2 R16.2 R17.1 R18.1
GND: C27.2 C28.2 C29.2 C30.2 C31.2 C32.2 C33.2 C34.2 C35.2 C36.2 C37.1 C38.2 IC7.5(VSS) IC8.1(GND) IC8.5(GND) IC8.10(AGND) IC8.11(GND) IC8.13(TEST) IC8.15(GND) IC8.25(GND) IC8.35(GND) IC8.47(GND) IC8.51(GND) R14.2 X1.2 X1.4
+1V8: C27.1 C28.1 C29.1 C35.1 IC8.12(VCORE) IC8.37(VCORE) IC8.49(VREGOUT) IC8.64(VCORE)
CDONE_S: IC8.23(ADBUS6) ; port CDONE
CS_S: IC8.21(ADBUS4) ; port CS
MISO_S: IC8.18(ADBUS2) ; port MISO
MOSI_S: IC8.17(ADBUS1) ; port MOSI
RESET_S: IC8.24(ADBUS7) ; port CRESET
SCK_S: IC8.16(ADBUS0) ; port SCK
USB_D_N: IC8.7(DM) ; port D_N
USB_D_P: IC8.8(DP) ; port D_P
NetC30_1: C30.1 C31.1 FB1.2 IC8.9(VPLL)
NetC32_1: C32.1 C33.1 FB2.2 IC8.4(VPHY)
NetC36_1: C36.1 IC8.2(OSCI) X1.1
NetC37_2: C37.2 IC8.3(OSCO) X1.3
NetIC7_1: IC7.1(CS) IC8.63(EECS) R18.2
NetIC7_2: IC7.2(CLK) IC8.62(EECLK) R17.2
NetIC7_3: IC7.3(DI) IC8.61(EEDATA) R15.2
NetIC7_4: IC7.4(DO) R15.1 R16.1
NetIC8_6: IC8.6(REF) R14.1
NetIC8_14: IC8.14(~{RST}) R13.1
NetIC8_38: IC8.38(BDBUS0) ; port D0
NetIC8_39: IC8.39(BDBUS1) ; port D1
NetIC8_40: IC8.40(BDBUS2) ; port D2
NetIC8_41: IC8.41(BDBUS3) ; port D3
NetIC8_43: IC8.43(BDBUS4) ; port D4
NetIC8_44: IC8.44(BDBUS5) ; port D5
NetIC8_45: IC8.45(BDBUS6) ; port D6
NetIC8_46: IC8.46(BDBUS7) ; port D7
NetIC8_48: IC8.48(BCBUS0) ; port RXF#
NetIC8_52: IC8.52(BCBUS1) ; port TXE#
NetIC8_53: IC8.53(BCBUS2) ; port RD#
NetIC8_54: IC8.54(BCBUS3) ; port WR#
NetIC8_55: IC8.55(BCBUS4) ; port SIWU

Not connected (* = marked no-connect by the designer): IC7 7(NC)*; IC8 19(ADBUS3)* 22(ADBUS5)* 26(ACBUS0)* 27(ACBUS1)* 28(ACBUS2)* 29(ACBUS3)* 30(ACBUS4)* 32(ACBUS5)* 33(ACBUS6)* 34(ACBUS7)* 36(~{SUSPEND})* 57(BCBUS5)* 58(BCBUS6)* 59(BCBUS7)* 60(~{PWREN})*

### Layout directives
differential pair: USB_D_N, USB_D_P

### Notes on the sheet
- FTDI Interface
- (near C27) Pin35
- Pin11
- (near C28) x3
- Pin1
- Pin5
- Pin10
- (near IC8) FTDI Chip
- Channel A - MPSSE (SPI)
- (near X1) x2
- Channel B - FIFO 245
- EEPROM
- Title:
- Size:
- Author:
- A4
- Sheet
- of
- Revision:
- File:
- Date:
- (in symbol Cap Pol) +

### Library data of the parts
C27-C30 C33-C37 = Cap: Capacitor no polarizado
C31 C32 = Cap Pol: Capacitor polarizado
C38 = Cap: as C40 on sheet MercurialSDR_MISC; Temp Coef: X7R; Part Number: CL10B104KO8NNNC; VR: 16V
FB1 FB2 = Ferrite Bead: Part Number: BLM18AG121SN1D; In: Ferrite Bead
IC7 = 93LC56BT/SN: EEPROM SPI 2kb (128x16); Part Number: 93LC56BT/SN
IC8 = FT2232H: USB bridge
R13-R18 = Res: Resistor
  R14: Power: 1/10W; Part Number: CR0603-FX-1202ELF; Tolerance: 1%
X1 = XTAL_4term: Oscilador a Cristal; Part Number: ECS-120-12-33-AGN-TR

## Sheet MercurialSDR_PWR.SchDoc: p2020 v1
size A4; Author: RF-Lab; DrawnBy: RF-Lab; Revision: Rev1.0; SheetNumber: 2; SheetTotal: 6
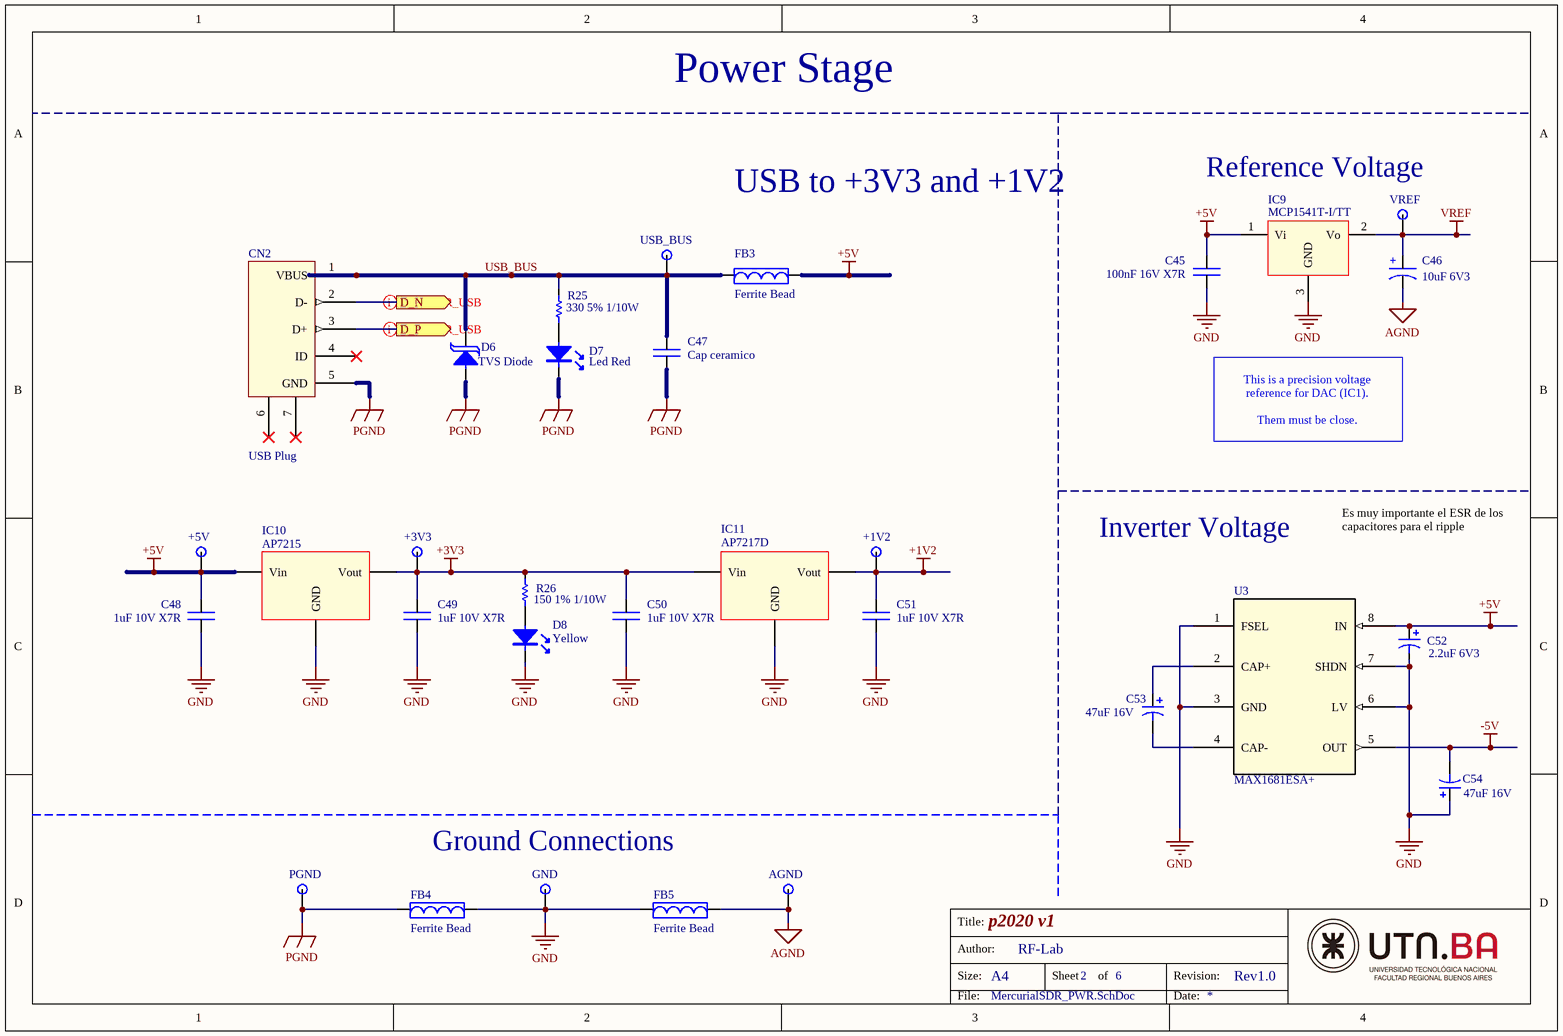
[diagram p5: MercurialSDR_PWR.SchDoc]

### Parts
C45  value 100nF 16V X7R  [CAP_0603]  (hidden comment: 100nF 16V X7R - CL10B104KO8NNNC)
C46  value 10uF 6V3  [CAP_TANT_1206]  (hidden comment: 10uF 6V3 - TAJA106K006RNJ)
C47  value Cap ceramico  [CAP_0603]  (hidden comment: 10nF 16v X7R  - CC0603KRX7R7BB103)
C48  value 1uF 10V X7R  [CAP_0603]  (hidden comment: 1uF 10V X7R - CL10B105KP8NNNC)
C49  value 1uF 10V X7R  [CAP_0603]  (hidden comment: 1uF 10V X7R - CL10B105KP8NNNC)
C50  value 1uF 10V X7R  [CAP_0603]  (hidden comment: 1uF 10V X7R - CL10B105KP8NNNC)
C51  value 1uF 10V X7R  [CAP_0603]  (hidden comment: 1uF 10V X7R - CL10B105KP8NNNC)
C52  value 2.2uF 6V3  [CAP_0603]  (hidden comment: 2.2uF 6V3 -  TMCJ1A225MTRF)
C53  value 47uF 16V  [CAPPC5932X280N]  (hidden comment: 47uF 16V - 595D476X9016C2T)
C54  value 47uF 16V  [CAPPC5932X280N]  (hidden comment: 47uF 16V - 595D476X9016C2T)
CN2  value USB Plug  [54819-0589_MOL]  (hidden comment: 54819-0589)
D6  value TVS Diode  [DO-214AC]  (hidden comment: SMAJ5.0A)
D7  Color: Led Red  [LED_0603]  (hidden comment: LTST-C190KRKT)
D8  Color: Yellow  [LED_0603]  (hidden comment: LTST-C190KSKT)
FB3  value Ferrite Bead  [FERRITE_BEAD_0603]  (hidden comment: BLM18AG121SN1D)
FB4  value Ferrite Bead  [FERRITE_BEAD_0603]  (hidden comment: BLM18AG121SN1D)
FB5  value Ferrite Bead  [FERRITE_BEAD_0603]  (hidden comment: BLM18AG121SN1D)
IC9  MCP1541T-I/TT  [SOT-23-3]
IC10  value AP7215  [SOT89-3L]  (hidden comment: AP7215 - AP7365-33YG-13)
IC11  value AP7217D  [SOT89-3L]  (hidden comment: AP7217D - AP7217D-12YG-13)
R25  value 330 5% 1/10W  [RES_0603]  (hidden comment: 330 5% 1/10W - CR0603-JW-331ELF)
R26  value 150 1% 1/10W  [RES_0603]  (hidden comment: 150 1% 1/10W - CR0603-FX-1500ELF)
TP6  TP Name: VREF  [TP_TH]  (hidden comment: Test Point)
TP7  TP Name: USB_BUS  [TP_TH]  (hidden comment: Test Point)
TP8  TP Name: +5V  [TP_TH]  (hidden comment: Test Point)
TP9  TP Name: +3V3  [TP_TH]  (hidden comment: Test Point)
TP10  TP Name: +1V2  [TP_TH]  (hidden comment: Test Point)
TP11  TP Name: PGND  [TP_TH]  (hidden comment: Test Point)
TP12  TP Name: GND  [TP_TH]  (hidden comment: Test Point)
TP13  TP Name: AGND  [TP_TH]  (hidden comment: Test Point)
U3  MAX1681ESA+  [max1681]

### Ports
D_N (out), D_P (out)

### Nets
+1V2: C51.1 IC11.3(Vout) TP10.1(TP?)
+3V3: C49.1 C50.1 IC10.1(Vout) IC11.2(Vin) R26.1 TP9.1(TP?)
+5V: C45.1 C48.1 C52.1 FB3.2 IC9.1(Vi) IC10.3(Vin) TP8.1(TP?) U3.8(IN)
-5V: C54.2 U3.5(OUT)
AGND: C46.2 FB5.2 TP13.1(TP?)
GND: C45.2 C48.2 C49.2 C50.2 C51.2 C52.2 C54.1 D8.2(K) FB4.2 FB5.1 IC9.3(GND) IC10.2(GND) IC11.1(GND) TP12.1(TP?) U3.1(FSEL) U3.3(GND) U3.6(LV) U3.7(SHDN)
PGND: C47.2 CN2.5(GND) D6.1(A) D7.2(K) FB4.1 TP11.1(TP?)
VREF: C46.1 IC9.2(Vo) TP6.1(TP?)
USB_BUS: C47.1 CN2.1(VBUS) D6.2(K) FB3.1 R25.1 TP7.1(TP?)
USB_D_N: CN2.2(D-) ; port D_N
USB_D_P: CN2.3(D+) ; port D_P
NetC53_1: C53.1 U3.2(CAP+)
NetC53_2: C53.2 U3.4(CAP-)
NetD7_1: D7.1(A) R25.2
NetD8_1: D8.1(A) R26.2

Not connected (* = marked no-connect by the designer): CN2 4(ID)* 6(Shield)* 7(Shield)*

### Layout directives
differential pair: USB_D_N, USB_D_P

### Notes on the sheet
- Power Stage
- (near TP6) Reference Voltage
- USB to +3V3 and +1V2
- This is a precision voltage
  reference for DAC (IC1).
  Them must be close.
- Inverter Voltage
- Es muy importante el ESR de los capacitores para el ripple
- (near TP12) Ground Connections
- Title:
- Size:
- Author:
- A4
- Sheet
- of
- Revision:
- File:
- Date:
- (in symbol Cap Pol) +

### Library data of the parts
C45 C47-C51 = Cap: Capacitor no polarizado
C46 = Cap Pol: Capacitor polarizado
C52-C54 = Cap Pol1: Capacitor Polarizado; Published: 8-Jun-2000; LatestRevisionDate: 17-Jul-2002; LatestRevisionNote: Re-released for DXP Platform.; PackageReference: RB7.6-15; Publisher: Altium Limited; PackageDescription: Polarized Capacitor (Radial); 2 Leads
CN2 = USB Plug: Mini-USB Plug
D6 = TVS_DIODE: TVS Diode (Supresor de transitorios)
D7 = Led
D8 = Led: Led Yellow
FB3 = Ferrite Bead: In: 800mA
FB4 FB5 = Ferrite Bead
IC9 = MCP1541: Reference Voltage; Reference Voltage: 4.096V; Part Number: MCP1541T-I/TT
IC10 = AP7215: Linear Voltage Regulator 3v3
IC11 = AP7217D: Linear Voltage Regulator 1V2
R25 R26 = Res: Resistor
U3 = MAX1681: Voltage converter; Vendor: Maxim Integrated Products; Built_By: EMA_UL_Team; SourceLibrary: Maxim_2011-10-27; Manufacturer_Part_Number: MAX1681ESA+; Copyright: Copyright (C) 2018 Accelerated Designs. All rights reserved; RefDes: RefDes; Type: DEV

## Nets that join several sheets
+1V2: MercurialSDR_FPGA_P&P (11 pins), MercurialSDR_PWR (C51.1 IC11.3 TP10.1)
+3V3: MercurialSDR_MISC (12 pins), MercurialSDR_FPGA_P&P (26 pins), MercurialSDR_FTDI (15 pins), MercurialSDR_PWR (6 pins)
+5V: MercurialSDR_MISC (CN1.1 CN1.2), MercurialSDR_FPGA_BNK (12 pins), MercurialSDR_PWR (8 pins)
-5V: MercurialSDR_FPGA_BNK (C6.2 C7.2 IC3.4 IC4.4), MercurialSDR_PWR (C54.2 U3.5)
AGND: MercurialSDR_FPGA_BNK (17 pins), MercurialSDR_PWR (C46.2 FB5.2 TP13.1)
GND: MercurialSDR_MISC (12 pins), MercurialSDR_FPGA_BNK (6 pins), MercurialSDR_FPGA_P&P (23 pins), MercurialSDR_FTDI (26 pins), MercurialSDR_PWR (18 pins)
VREF: MercurialSDR_FPGA_BNK (IC2.3), MercurialSDR_PWR (C46.1 IC9.2 TP6.1)
CDONE_S: MercurialSDR_FPGA_P&P (D2.1 R7.2 U1.65), MercurialSDR_FTDI (IC8.23)
CS_S: MercurialSDR_FPGA_P&P (JP2.2 U1.71), MercurialSDR_FTDI (IC8.21)
MISO_S: MercurialSDR_FPGA_P&P (IC6.2 JP1.2), MercurialSDR_FTDI (IC8.18)
MOSI_S: MercurialSDR_FPGA_P&P (IC6.5 JP1.3), MercurialSDR_FTDI (IC8.17)
NetC41_2: MercurialSDR_MISC (C41.2 R19.2 SW2.4), MercurialSDR_FPGA_BNK (U1.93)
NetC42_2: MercurialSDR_MISC (C42.2 R20.2 SW3.4), MercurialSDR_FPGA_BNK (U1.26)
NetC43_2: MercurialSDR_MISC (C43.2 R21.2 SW4.4), MercurialSDR_FPGA_BNK (U1.144)
NetCN1_5: MercurialSDR_MISC (CN1.5), MercurialSDR_FPGA_BNK (U1.1)
NetCN1_6: MercurialSDR_MISC (CN1.6), MercurialSDR_FPGA_BNK (U1.2)
NetCN1_7: MercurialSDR_MISC (CN1.7), MercurialSDR_FPGA_BNK (U1.3)
NetCN1_8: MercurialSDR_MISC (CN1.8), MercurialSDR_FPGA_BNK (U1.4)
NetCN1_9: MercurialSDR_MISC (CN1.9), MercurialSDR_FPGA_BNK (U1.7)
NetCN1_10: MercurialSDR_MISC (CN1.10), MercurialSDR_FPGA_BNK (U1.8)
NetCN1_11: MercurialSDR_MISC (CN1.11), MercurialSDR_FPGA_BNK (U1.9)
NetCN1_12: MercurialSDR_MISC (CN1.12), MercurialSDR_FPGA_BNK (U1.10)
NetCN1_13: MercurialSDR_MISC (CN1.13), MercurialSDR_FPGA_BNK (U1.11)
NetCN1_14: MercurialSDR_MISC (CN1.14), MercurialSDR_FPGA_BNK (U1.12)
NetCN1_15: MercurialSDR_MISC (CN1.15), MercurialSDR_FPGA_BNK (U1.28)
NetCN1_16: MercurialSDR_MISC (CN1.16), MercurialSDR_FPGA_BNK (U1.29)
NetCN1_17: MercurialSDR_MISC (CN1.17), MercurialSDR_FPGA_BNK (U1.31)
NetCN1_18: MercurialSDR_MISC (CN1.18), MercurialSDR_FPGA_BNK (U1.32)
NetCN1_19: MercurialSDR_MISC (CN1.19), MercurialSDR_FPGA_BNK (U1.33)
NetCN1_20: MercurialSDR_MISC (CN1.20), MercurialSDR_FPGA_BNK (U1.34)
NetIC8_38: MercurialSDR_FPGA_BNK (U1.62), MercurialSDR_FTDI (IC8.38)
NetIC8_39: MercurialSDR_FPGA_BNK (U1.61), MercurialSDR_FTDI (IC8.39)
NetIC8_40: MercurialSDR_FPGA_BNK (U1.60), MercurialSDR_FTDI (IC8.40)
NetIC8_41: MercurialSDR_FPGA_BNK (U1.56), MercurialSDR_FTDI (IC8.41)
NetIC8_43: MercurialSDR_FPGA_BNK (U1.55), MercurialSDR_FTDI (IC8.43)
NetIC8_44: MercurialSDR_FPGA_BNK (U1.45), MercurialSDR_FTDI (IC8.44)
NetIC8_45: MercurialSDR_FPGA_BNK (U1.44), MercurialSDR_FTDI (IC8.45)
NetIC8_46: MercurialSDR_FPGA_BNK (U1.43), MercurialSDR_FTDI (IC8.46)
NetIC8_48: MercurialSDR_FPGA_BNK (U1.42), MercurialSDR_FTDI (IC8.48)
NetIC8_52: MercurialSDR_FPGA_BNK (U1.41), MercurialSDR_FTDI (IC8.52)
NetIC8_53: MercurialSDR_FPGA_BNK (U1.39), MercurialSDR_FTDI (IC8.53)
NetIC8_54: MercurialSDR_FPGA_BNK (U1.38), MercurialSDR_FTDI (IC8.54)
NetIC8_55: MercurialSDR_FPGA_BNK (U1.37), MercurialSDR_FTDI (IC8.55)
NetOSC1_3: MercurialSDR_MISC (OSC1.3), MercurialSDR_FPGA_BNK (U1.21)
NetR22_2: MercurialSDR_MISC (R22.2), MercurialSDR_FPGA_BNK (U1.78)
NetR23_2: MercurialSDR_MISC (R23.2), MercurialSDR_FPGA_BNK (U1.83)
RESET_S: MercurialSDR_FPGA_P&P (D1.2), MercurialSDR_FTDI (IC8.24)
SCK_S: MercurialSDR_FPGA_P&P (IC6.6 R5.2 U1.70), MercurialSDR_FTDI (IC8.16)
USB_D_N: MercurialSDR_FTDI (IC8.7), MercurialSDR_PWR (CN2.2)
USB_D_P: MercurialSDR_FTDI (IC8.8), MercurialSDR_PWR (CN2.3)